# Altium schematic sheet Freedom Board Interface.SchDoc
size A4
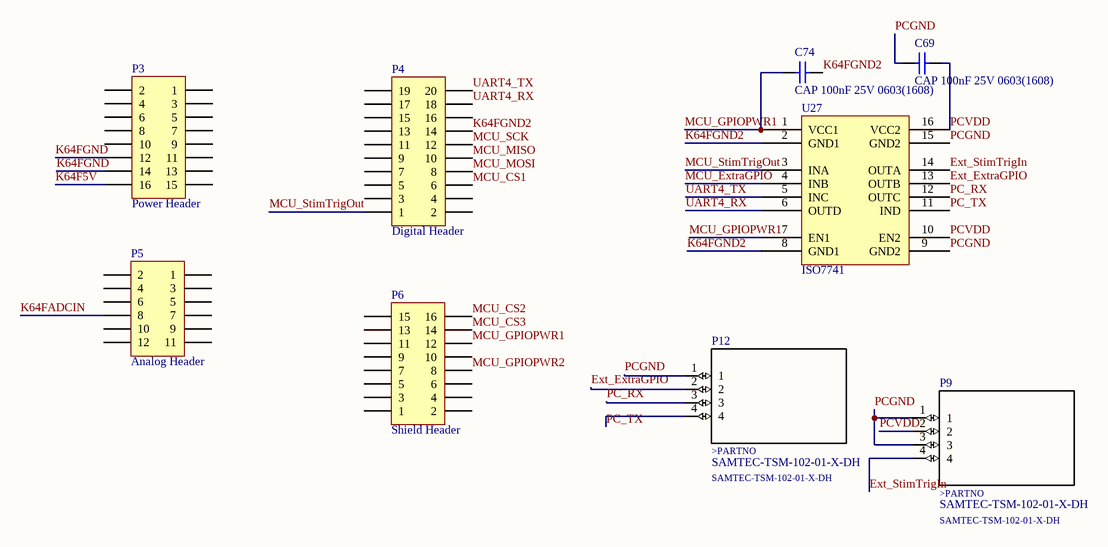
[diagram p0: Freedom Board Interface.SchDoc]

## Parts
C69  CAP 100nF 25V 0603(1608)  [CAPC0603(1608)100_N]
C74  CAP 100nF 25V 0603(1608)  [CAPC0603(1608)100_N]
P3  Power Header  [HDR2X8]
P4  Digital Header  [HDR2X10]
P5  Analog Header  [HDR2X6]
P6  Shield Header  [HDR2X8]
P9  SAMTEC-TSM-102-01-X-DH  [*SAMTEC-TSM-102-01-X-DH]
P12  SAMTEC-TSM-102-01-X-DH  [*SAMTEC-TSM-102-01-X-DH]
U27  ISO7741  [16SSOP JEDEC MO-137 AB]

## Nets
Ext_ExtraGPIO: P12.2 U27.13(OUTB)
Ext_StimTrigIn: P9.4 U27.14(OUTA)
K64F5V: P3.16
K64FADCIN: P5.8
K64FGND: P3.12 P3.14
K64FGND2: C74.1 P4.14 U27.2(GND1) U27.8(GND1)
MCU_CS1: P4.6
MCU_CS2: P6.16
MCU_CS3: P6.14
MCU_ExtraGPIO: U27.4(INB)
MCU_GPIOPWR1: C74.2 P6.12 U27.1(VCC1) U27.7(EN1)
MCU_GPIOPWR2: P6.8
MCU_MISO: P4.10
MCU_MOSI: P4.8
MCU_SCK: P4.12
MCU_StimTrigOut: P4.1 U27.3(INA)
PC_RX: P12.3 U27.12(OUTC)
PC_TX: P12.4 U27.11(IND)
PCGND: C69.2 P9.1 P9.3 P12.1 U27.9(GND2) U27.15(GND2)
PCVDD: C69.1 P9.2 U27.10(EN2) U27.16(VCC2)
UART4_RX: P4.18 U27.6(OUTD)
UART4_TX: P4.20 U27.5(INC)

Not connected (* = marked no-connect by the designer): P3 1 2 3 4 5 6 7 8 9 10 11 13 15; P4 2 3 4 5 7 9 11 13 15 16 17 19; P5 1 2 3 4 5 6 7 9 10 11 12; P6 1 2 3 4 5 6 7 9 10 11 13 15

## Notes on the sheet
- (in symbol SAMTEC-TSM-102-01-X-DH) >PARTNO

## Library data of the parts
C69 C74 = CMP-1035-02589-1: CAP 100nF 25V ±20% 0603 (1608 Metric) Thickness 1mm SMD; Case-EIA: 0603; Tolerance: Â±20%; Case-Metric: 1608; Value: 100nF; Max Thickness: 1 mm; Technology: SMT; Rated Voltage: 25 V
P3 P6 = Header 8X2: Header, 8-Pin, Dual row; LatestRevisionDate: 17-Jul-2002; LatestRevisionNote: Re-released for DXP Platform.; Publisher: Altium Limited
P4 = Header 10X2: Header, 10-Pin, Dual row; LatestRevisionDate: 17-Jul-2002; LatestRevisionNote: Re-released for DXP Platform.; Publisher: Altium Limited
P5 = Header 6X2: Header, 6-Pin, Dual row; LatestRevisionDate: 17-Jul-2002; LatestRevisionNote: Re-released for DXP Platform.; Publisher: Altium Limited
P9 P12 = SAMTEC-TSM-102-01-X-DH: Conn Unshrouded Header HDR 4 POS 2.54mm Solder RA SMD; MF: Samtec Inc.; MP: TSM-102-01-F-DH; SnapEDA_Link: https://www.snapeda.com/parts/TSM-102-01-F-DH/Samtec%20Inc./view-part/?ref=snap; Digi-Key_Part_Number: TSM-102-01-F-DH-ND; Digi-Key_Purchase_URL: https://www.digikey.com/product-detail/en/samtec-inc/TSM-102-01-F-DH/TSM-102-01-F-DH-ND/7623426?utm_source=snapeda&utm_medium=aggregator&utm_campaign=symbol; Package: None; Value: *
U27 = ISO7741: Capacitive Digital Isolator, 3 forward channels, 1 reverse channel, failsafe high, 100 Mbps, 2.25-5.5V